# Altium schematic sheet complete.SchDoc (part 2 of 2)
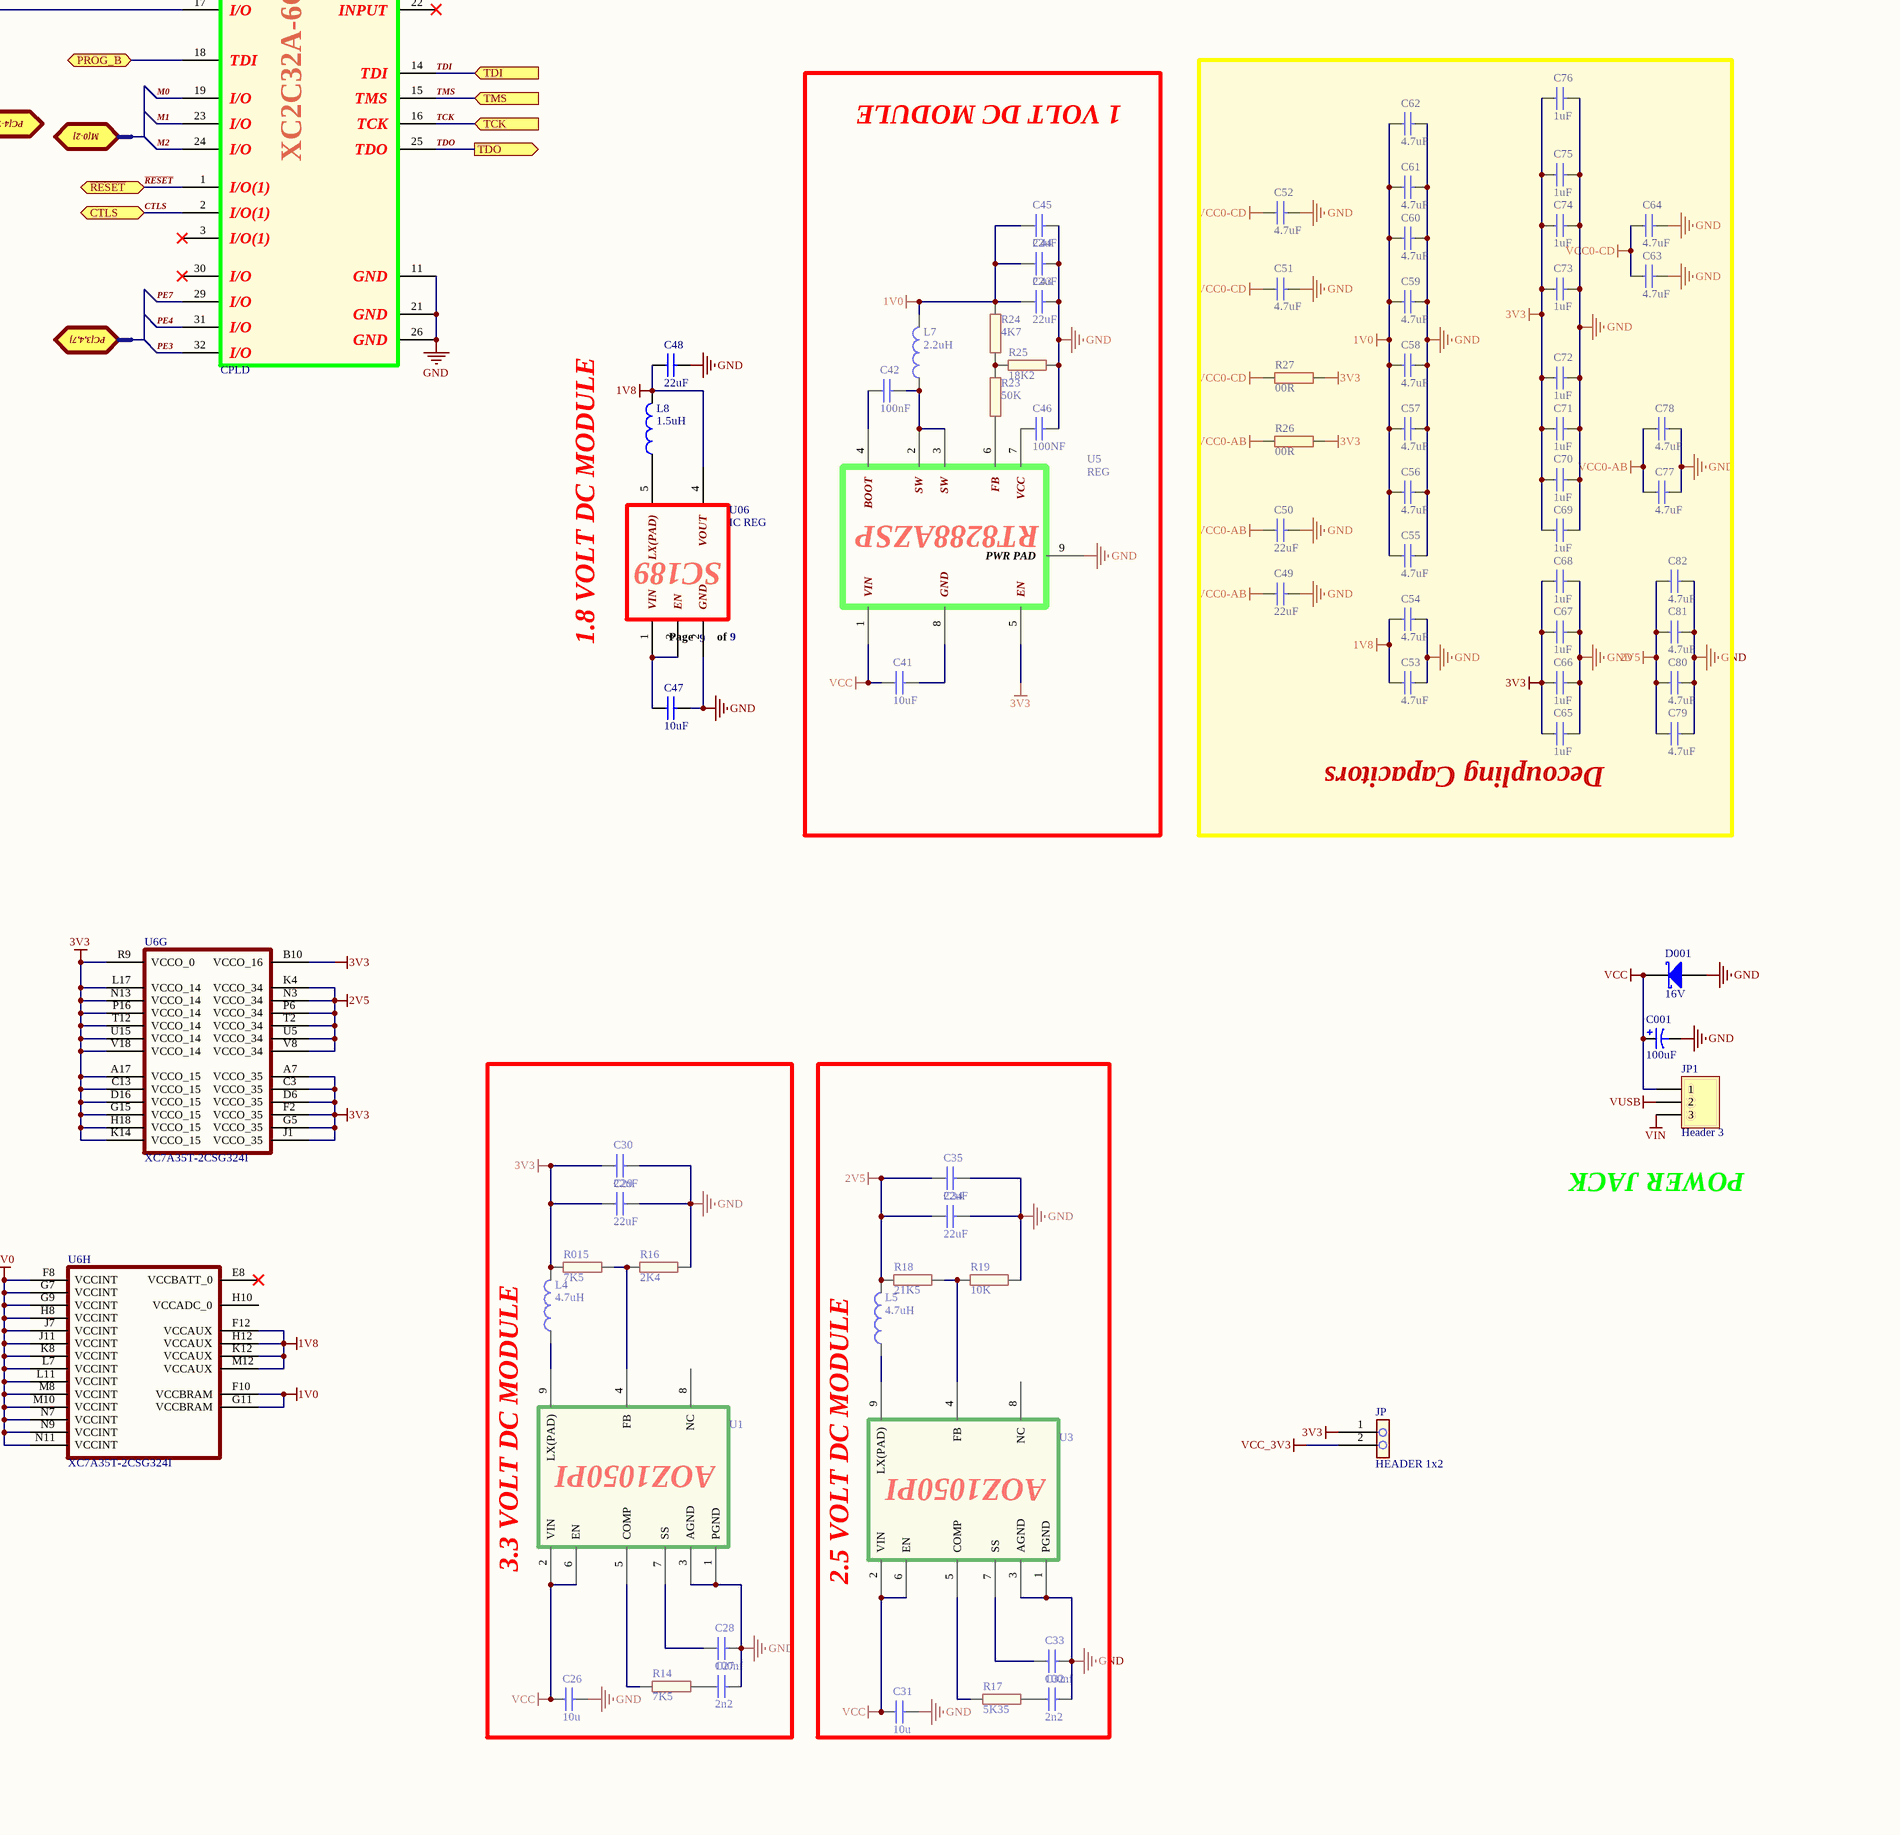
[diagram p6: complete.SchDoc, bottom right]

## Library data of the parts
B1 B1A = Balun_2.4GHz: 2.45 GHz Balun / Filter Combination; PartGroup: Inductors,RF,Other RF; Manufacturer: Johanson Technology; AN: A03-0130; TemperatureRange: -40 to +85; ComponentStatus: 'Active (verified)'; Height: 1; MPN: 2450FB15A050; FootprintStatus: 'Active (Verified)'
C01 C002 C49-C68 = CAP-NONPOL: Ceramic capacitor, SMD 0402, X5R, 6.3V, +/-20% (de33687); PartGroup: Capacitors,Ceramic,SMD 0402; Manufacturer: Murata; MPN: GRM155R60J475ME87D; AN: A01-0347; Tolerance: +-20%; TemperatureRange: -55°C to +85°C; ComponentStatus: 'Active (verified)'; Status: Active; Verified by: Lars Helge Mo; Verified date: 2005-12-15; Height: 0,5; FootprintStatus: 'Active (Verified)'
C1 C1A C9 C11 C13 C13A C14 C14A C15 C15A C16 C16A C17 C17A C110 = A01-0246: Ceramic capacitor, SMD 0402, X7R, 16V, +/-10%; PartGroup: Capacitors,Ceramic,SMD 0402; Manufacturer: Kemet; MPN: C0402C104K4RACTU; TemperatureRange: -55 - +125 deg C; ComponentStatus: 'Active (verified)'; Status: Active; Verified by: Lars Helge Mo; Verified date: 2005-12-15; AN: A01-0246; Tolerance: 16V, +/-10%; Height: 0.5; FootprintStatus: 'Active (Verified)'
C001 = Cap Pol1: Polarized Capacitor (Radial); Published: 8-Jun-2000; LatestRevisionDate: 17-Jul-2002; LatestRevisionNote: Re-released for DXP Platform.; PackageReference: RB7.6-15; Publisher: Altium Limited; PackageDescription: Polarized Capacitor (Radial); 2 Leads
C2 C02A C12 C12A = A01-0682: CAP CER 1.8PF 25V NP0 0201; PartGroup: Capacitors,Ceramic,SMD 0201; Tolerance: Â±0.1pF; TemperatureRange: -55Â°C ~ 125Â°C; ComponentStatus: 'New (not verified)'; Status: Active; Verified by: Lars Helge Mo; Verified date: 2005-12-15; AN: A01-0682; FootprintStatus: 'Active (Verified)'
C3 C3A = A01-0683: CAP CER 0.8PF 25V NP0 0201; PartGroup: Capacitors,Ceramic,SMD 0201; Manufacturer: Johanson Technology; MPN: 250R05L0R8AV4T; Tolerance: Â±0.05pF; TemperatureRange: -55Â°C ~ 125Â°C; ComponentStatus: 'New (not verified)'; Status: Active; Verified by: Lars Helge Mo; Verified date: 2005-12-15; AN: A01-0683; FootprintStatus: 'Active (Verified)'
C4 C4A C21 C21A = A01-0612: Ceramic Capacitor, SMD 0201, 25V, NP0, 1.2pF; PartGroup: Capacitors,Ceramic,SMD 0201; ComponentStatus: 'Active (verified)'; Status: Active; Verified by: Lars Helge Mo; Verified date: 2005-12-15; AN: A01-0612; FootprintStatus: 'Active (Verified)'
C5 C5A = A01-0681: CAP CER 8.2PF 25V NP0 0201; PartGroup: Capacitors,Ceramic,SMD 0201; Manufacturer: Johanson Technology; MPN: 250R05L8R2CV4T; Tolerance: Â±0.25pF; TemperatureRange: -55Â°C ~ 125Â°C; ComponentStatus: 'New (not verified)'; Status: Active; Verified by: Lars Helge Mo; Verified date: 2005-12-15; AN: A01-0681; FootprintStatus: 'Active (Verified)'
C7 C7A C22 C22A = A01-0472: CAP CER 2.2PF 6.3V NP0 0201; PartGroup: Capacitors,Ceramic,SMD 0201; Manufacturer: Kemet; MPN: CBR02C229C9GAC; Tolerance: ±0.25pF; TemperatureRange: -55°C ~ 125°C; ComponentStatus: 'Active (verified)'; Status: Active; Verified by: Lars Helge Mo; Verified date: 2005-12-15; AN: A01-0472; Height: 0.300000011920929; FootprintStatus: 'Active (Verified)'
C8 C08A = A01-0611: CAP CER 15PF 25V NP0 0201; PartGroup: Capacitors,Ceramic,SMD 0201; Manufacturer: Murata; MPN: GRM0335C1E150JA01D; Tolerance: Â±5%; TemperatureRange: -55Â°C to 125Â°C; ComponentStatus: 'Active (verified)'; Status: Active; Verified by: Lars Helge Mo; Verified date: 2005-12-15; AN: A01-0611; Height: 0.300000011920929; FootprintStatus: 'Active (Verified)'
C10 C10A = A01-0581: CAP CER 10PF 25V Â±.25pf ( and Â±.30ppm/ degree C of temp variation) NP0 0201; PartGroup: Capacitors,Ceramic,SMD 0201; Manufacturer: tdk; MPN: C0603C0G1E100C; Tolerance: Â±20ppm to Â±50ppm; TemperatureRange: -55CÂº ~ +125ÂºC; ComponentStatus: 'Active (verified)'; Status: Active; Verified by: Lars Helge Mo; Verified date: 2005-12-15; AN: A01-0581; FootprintStatus: 'Active (Verified)'
C18 C18A C19 C19A C20 C20A = A01-0286: Ceramic capacitor, SMD 0402, X5R, 6.3V, +/-10% (de26942); PartGroup: Capacitors,Ceramic,SMD 0402; Manufacturer: Kemet; MPN: C0402C105K9PAC; TemperatureRange: -55 to 85 deg C; ComponentStatus: 'Active (verified)'; Status: Active; Verified by: Lars Helge Mo; Verified date: 2005-12-15; AN: A01-0286; Tolerance: +/-10%; Height: 0.5; FootprintStatus: 'Active (Verified)'
C23 C230 = A01-0276: Ceramic capacitor, SMD 1206, X5R, 6.3V, ±10%; PartGroup: Capacitors,Ceramic,SMD 1206; Manufacturer: Murata; MPN: GRM319R60J106KE19; TemperatureRange: -55 to +125; ComponentStatus: 'Active (verified)'; Status: Active; Verified by: Lars Helge Mo; Verified date: 2005-12-15; AN: A01-0276; Tolerance: ±10%; Height: 0.850000023841858; FootprintStatus: 'Active (Verified)'
C24 C24A = A01-0351: Ceramic capacitor, SMD 0402, NP0, 50V, +/-0.25pF (de23847); PartGroup: Capacitors,Ceramic,SMD 0402; Manufacturer: Murata; MPN: GRM1555C1H2R2CZ01D; Tolerance: 0,25pF; TemperatureRange: -55ï¿½C to +125ï¿½C; ComponentStatus: 'Active (verified)'; Status: Active; Verified by: Lars Helge Mo; Verified date: 2005-12-15; AN: A01-0351; FootprintStatus: 'Active (Verified)'
C024A = A01-0351: Ceramic capacitor, SMD 0402, NP0, 50V, +/-0.25pF (de23847); PartGroup: Capacitors,Ceramic,SMD 0402; Manufacturer: Murata; MPN: GRM1555C1H2R2CZ01D; Value: 2.2pF; Tolerance: 0,25pF; TemperatureRange: -55ï¿½C to +125ï¿½C; ComponentStatus: 'Active (verified)'; Status: Active; Verified by: Lars Helge Mo; Verified date: 2005-12-15; AN: A01-0351; FootprintStatus: 'Active (Verified)'
C25 C25A = A01-0577: Ceramic capacitor, SMD 0201, X7R, 10V, +/-10%; PartGroup: Capacitors,Ceramic,SMD 0201; Manufacturer: Johanson Technology; MPN: 100R05W102KV4; ComponentStatus: 'New (not verified)'; Status: Active; Verified by: Lars Helge Mo; Verified date: 2005-12-15; AN: A01-0577; FootprintStatus: 'Active (Verified)'
C26 C27 C31 C32 = CAP-NONPOL_1: Ceramic capacitor, SMD 1206, X5R, 6.3V, ±10%; PartGroup: Capacitors,Ceramic,SMD 1206; Manufacturer: Murata; MPN: GRM319R60J106KE19; AN: A01-0276; TemperatureRange: -55 to +125; ComponentStatus: 'Active (verified)'; Status: Active; Verified by: Lars Helge Mo; Verified date: 2005-12-15; Tolerance: ±10%; Height: 0.850000023841858; FootprintStatus: 'Active (Verified)'
C28 C33 = CAP-NONPOL_1: PartGroup: Capacitors,Ceramic,SMD 1206; Manufacturer: Murata; MPN: GRM319R60J106KE19; AN: A01-0276; Tolerance: ±10%; TemperatureRange: -55 to +125; ComponentStatus: 'Active (verified)'; Status: Active; Verified by: Lars Helge Mo; Verified date: 2005-12-15; Height: 0.850000023841858; FootprintStatus: 'Active (Verified)'
C29 C30 C34 C35 C41-C48 = CAP-NONPOL_2: PartGroup: Capacitors,Ceramic,SMD 0402; Manufacturer: Murata; MPN: GRM1555C1H2R2CZ01D; AN: A01-0351; Tolerance: 0,25pF; TemperatureRange: -55ï¿½C to +125ï¿½C; ComponentStatus: 'Active (verified)'; Status: Active; Verified by: Lars Helge Mo; Verified date: 2005-12-15; FootprintStatus: 'Active (Verified)'
C69-C82 = CAP-NONPOL: PartGroup: Capacitors,Ceramic,SMD 0402; Manufacturer: Murata; MPN: GRM155R60J475ME87D; AN: A01-0347; Tolerance: +-20%; TemperatureRange: -55°C to +85°C; ComponentStatus: 'Active (verified)'; Status: Active; Verified by: Lars Helge Mo; Verified date: 2005-12-15; Height: 0,5; FootprintStatus: 'Active (Verified)'
C85-C97 = CAP-NONPOL_3: Ceramic capacitor, SMD 0201, X7R, 10V, +/-10%; PartGroup: Capacitors,Ceramic,SMD 0201; Manufacturer: Johanson Technology; MPN: 100R05W102KV4; AN: A01-0577; ComponentStatus: 'New (not verified)'; Status: Active; Verified by: Lars Helge Mo; Verified date: 2005-12-15; FootprintStatus: 'Active (Verified)'
D1 D1A = A10-0018: LED, Green, Wave length=575nm, SMD 0805, ±70°; PartGroup: Opto,LEDs,SMD; Manufacturer: Everlight; TemperatureRange: -40 - +85 deg C; ComponentStatus: 'Active (verified)'; Verified date: 2006-02-17; Verified by: Sveinung Helgeland; Status: Active; AN: A10-0018; Height: 1.10000002384186; MPN: EL17-21SYGC; FootprintStatus: 'Active (Verified)'
D001 DA DB DC DD = D Schottky: Schottky Diode; Published: 8-Jun-2000; LatestRevisionDate: 17-Jul-2002; LatestRevisionNote: Re-released for DXP Platform.; PackageReference: SMB; Publisher: Altium Limited; PackageDescription: DO-214-AA/SMB; 2 C-Bend Leads; Body 5.3 x 3.6 mm, inc. leads (LxW); Code_JEDEC: DO-214-AA
D2 D2A = A10-0019: LED, Yellow, Wave length=591nm, SMD 0805, ±70°; PartGroup: Opto,LEDs,SMD; Manufacturer: Everlight; MPN: 17-21UYC/S530-A3/TR8; TemperatureRange: -40 to +85 deg C; ComponentStatus: 'Active (verified)'; Verified date: 2006-02-17; Verified by: Sveinung Helgeland; Status: Active; AN: A10-0019; Height: 1.10000002384186; FootprintStatus: 'Active (Verified)'
D2A1 = LED0: Typical INFRARED GaAs LED; Published: 8-Jun-2000; LatestRevisionDate: 08-Jul-2005; LatestRevisionNote: Mech Layer 1 removed.; PackageReference: LED-0; Publisher: Altium Limited; PackageDescription: LED; 2 Leads
IC2 IC2A = AT24MAC602: IC EEPROM 2KBIT 1MHz, 1.7V to 5.5V, SOT23-5; PartGroup: Integrated Circuits,Memory,EEPROM; Manufacturer: ATMEL; AN: A06-0871; ComponentStatus: 'Active (verified)'; Status: *; Design comment: *; Verified by: *; Verified date: *; Height: 1.10000002384186; MPN: AT24MAC602-STUM-T; FootprintStatus: 'Active (Verified)'
IC7 IC7A = AT86RF215: Sub-1GHz/2.4GHz Transceiver; PartGroup: Integrated Circuits,Interface ICs,RF; Manufacturer: ATMEL; AN: A06-0976; Value: AT86RF215-ZU; TemperatureRange: -40Â°C to +85Â°C; ComponentStatus: 'Active (verified)'; MPN: AT86RF215-ZU; FootprintStatus: 'New (Not verified)'
IC8 = PL133-27: 1:2 FANOUT BUFFER IC
J1 J10 J104 J104A J105 J105A = A08-1754: 1x2 pin header, 2.54mm pitch, Pin-in-Paste THM; PartGroup: Mechanical devices,Connectors,Pin headers; Manufacturer: SAMTEC; TemperatureRange: - 55 deg C to + 125 deg C; ComponentStatus: 'Active (verified)'; Verified date: 2006-01-30; Verified by: Lars Helge; Status: Active; AN: A08-1754; Height: 6.09999990463257; MPN: HMTSW-102-23-F-S-237; FootprintStatus: 'Active (Verified)'
JP = A08-1754: 1x2 pin header, 2.54mm pitch, Pin-in-Paste THM; PartGroup: Mechanical devices,Connectors,Pin headers; Manufacturer: SAMTEC; MPN: HMTSW-102-23-F-S-237; TemperatureRange: - 55 deg C to + 125 deg C; ComponentStatus: 'Active (verified)'; Verified date: 2006-01-30; Verified by: Lars Helge; Status: Active; AN: A08-1754; Height: 6.09999990463257; FootprintStatus: 'Active (Verified)'
JP1 = Header 3: Header, 3-Pin; LatestRevisionDate: 17-Jul-2002; LatestRevisionNote: Re-released for DXP Platform.; Publisher: Altium Limited
L1 L1A = A03-0131: Sub-1GHz Balun; PartGroup: Inductors,RF,Other RF; Manufacturer: Murata; ComponentStatus: 'Active (verified)'; Common ode hoke: DLW21SN900SQ2; AN: A03-0131; MPN: DLW21SN900SQ2; FootprintStatus: 'New (Not verified)'
L2 L20 = A03-0072: SMD-Ferrite 220Ohm, 100MHz 0603 size, (de14411); PartGroup: Inductors,EMI; Manufacturer: Würth Elektronik; TemperatureRange: -55 - +125 deg C; ComponentStatus: 'Active (verified)'; AN: A03-0072; MPN: 74279263; FootprintStatus: 'Active (Verified)'
L3 L3A = A03-0150: PartGroup: Inductors,RF,SMD 0201; Manufacturer: Johanson Technology; MPN: L-05B5N6SV6T; Tolerance: ±0.3nH; TemperatureRange: -40°C ~ 100°C; ComponentStatus: 'Active (verified)'; Verified date: 2006-01-30; Verified by: Lars Helge Mo; Status: Active; AN: A03-0150; FootprintStatus: 'Active (Verified)'
L4 L5 L7 L8 = INDUCTOR: PartGroup: Inductors,RF,SMD 0201; Manufacturer: Johanson Technology; MPN: L-05B5N6SV6T; AN: A03-0150; Tolerance: ±0.3nH; TemperatureRange: -40°C ~ 100°C; ComponentStatus: 'Active (verified)'; Verified date: 2006-01-30; Verified by: Lars Helge Mo; Status: Active; FootprintStatus: 'Active (Verified)'
P1A = A08-0838: UFL (Small Coax Connector); PartGroup: Mechanical devices,Connectors,Coaxial; Manufacturer: HIROSE; ComponentStatus: 'Active (verified)'; AN: A08-0838; Height: 1.25; MPN: U.FL-R-SMT-1(10); FootprintStatus: 'Active (Verified)'
P4 = Header 2: Header, 2-Pin; LatestRevisionDate: 17-Jul-2002; LatestRevisionNote: Re-released for DXP Platform.; Publisher: Altium Limited
P-ADC = Header 10X2H: Header, 10-Pin, Dual row, Right Angle; LatestRevisionDate: 17-Jul-2002; LatestRevisionNote: Re-released for DXP Platform.; Publisher: Altium Limited
Pio = Header 20: Header, 20-Pin; LatestRevisionDate: 17-Jul-2002; LatestRevisionNote: Re-released for DXP Platform.; Publisher: Altium Limited
Q1 Q10 = A05-0051: Dual N-Channel MOSFET, 60V, 115mA cont,RDS(ON) < 7.5 Ohm @50mA@5V, SOT-363; PartGroup: Transistors,Small signal FET,SMD; Manufacturer: Fairchild; TemperatureRange: -65 to 150 deg C; ComponentStatus: 'Active (verified)'; Status: New; AN: A05-0051; Height: 1.10000002384186; MPN: 2N7002DW; FootprintStatus: 'Active (Verified)'
R001 R002 R018 R019 R032 R144-R147 = R2: Thick film resistor, SMD 0402, 1/16W, 1%; PartGroup: Resistors,SMD,0402 1%; AN: A02-0260; TemperatureRange: -55 - +125 deg C; ComponentStatus: 'Active (verified)'; Status: Active; Verified by: Lars Helge Mo; Verified date: 2005-12-19; Tolerance: 1 %; Height: 0,349999994039536; FootprintStatus: 'Active (Verified)'
R1 R1A R5 R5A = A02-0284: Thick film resistor, SMD 0402, 1/16W, 1%; PartGroup: Resistors,SMD,0402 1%; Manufacturer: KOA; MPN: RK73H1ETTP1004F; TemperatureRange: -55 - +125 deg C; ComponentStatus: 'Active (verified)'; Status: Active; Verified by: Lars Helge Mo; Verified date: 2005-12-19; AN: A02-0284; Tolerance: 1 %; Height: 0.349999994039536; FootprintStatus: 'Active (Verified)'
R2 R2A R3 R3A = A02-0200: Thick film resistor, SMD 0402, 1/16W, 1%; PartGroup: Resistors,SMD,0402 1%; TemperatureRange: -55 - +125 deg C; ComponentStatus: 'Active (verified)'; Status: Active; Verified by: Lars Helge Mo; Verified date: 2005-12-19; AN: A02-0200; Tolerance: 1 %; Height: 0.349999994039536; FootprintStatus: 'Active (Verified)'
R4 R4A R9 R9A = A02-0553: Thick film resistor, SMD 0201, 1/20W, 5%; PartGroup: Resistors,SMD,0201 5%; Manufacturer: ROHM; MPN: MCR006YZPJ000; ComponentStatus: 'Active (verified)'; Status: Active; Verified by: Lars Helge Mo; Verified date: 2005-12-19; AN: A02-0553; Tolerance: 5%; FootprintStatus: 'Active (Verified)'
R7 R7A = A02-0677: RES 100K OHM 1/20W 5% 0201 SMD; PartGroup: Resistors,SMD,0201 5%; Manufacturer: YAGEO CORP; MPN: RC0201JR-07100KL; ComponentStatus: 'Active (verified)'; Status: Active; Verified by: Lars Helge Mo; Verified date: 2005-12-19; AN: A02-0677; FootprintStatus: 'Active (Verified)'
R10 R10A R11 R11A R13 R13A = A02-0541: Thick film resistor, SMD 0201, 1/20W, 5%; PartGroup: Resistors,SMD,0201 5%; Manufacturer: ROHM; MPN: MCR006YZPJ103+; ComponentStatus: 'Active (verified)'; Status: Active; Verified by: Lars Helge Mo; Verified date: 2005-12-19; AN: A02-0541; Tolerance: 5%; FootprintStatus: 'Active (Verified)'
R12 R12A = A02-0196: Thick film resistor, SMD 0402, 1/16W, 1%; PartGroup: Resistors,SMD,0402 1%; TemperatureRange: -55 - +125 deg C; ComponentStatus: 'Active (verified)'; Status: Active; Verified by: Lars Helge Mo; Verified date: 2005-12-19; AN: A02-0196; Tolerance: 1 %; Height: 0.349999994039536; FootprintStatus: 'Active (Verified)'
R14 R015-R19 R23-R27 = R2_1: Thick film resistor, SMD 0201, 1/20W, 5%; PartGroup: Resistors,SMD,0201 5%; Manufacturer: ROHM; MPN: MCR006YZPJ103+; AN: A02-0541; ComponentStatus: 'Active (verified)'; Status: Active; Verified by: Lars Helge Mo; Verified date: 2005-12-19; Tolerance: 5%; FootprintStatus: 'Active (Verified)'
R15B R40-R51 R53-R58 R60-R79 = Res1: Resistor; Published: 8-Jun-2000; LatestRevisionDate: 17-Jul-2002; LatestRevisionNote: Re-released for DXP Platform.; PackageReference: AXIAL-0.3; Publisher: Altium Limited; PackageDescription: Axial Device, Thru-Hole; 2 Leads; 0.3 in Pin Spacing
R101 R101A R102 R102A = A02-0236: Thick film resistor, SMD 0402, 1/16W, 1%; PartGroup: Resistors,SMD,0402 1%; Manufacturer: vishay; MPN: CRCW040210K0FKED; TemperatureRange: -55 - +125 deg C; ComponentStatus: 'Active (verified)'; Status: Active; Verified by: Lars Helge Mo; Verified date: 2005-12-19; AN: A02-0236; Tolerance: 1 %; Height: 0.349999994039536; FootprintStatus: 'Active (Verified)'
SMA1-SMA4 = A08-1047: End Launch Jack Receptacle, Round Contact (de21535); Manufacturer: EMERSON; PartGroup: Mechanical devices,Connectors,Coaxial; Art.-Nr.: 21535; ComponentStatus: 'Active (verified)'; Manuf.Part#: 142-0711-821; AN: A08-1047; MPN: 142-0711-821; FootprintStatus: 'New (Not verified)'
TP1 TP1A TP2 TP2A TP10 TP10A TP11 TP11A TP12 TP12A TP13 TP13A = A08-0892: Single SMD testpad; PartGroup: Mechanical devices,Other; ComponentStatus: 'New (not verified)'; Status: Active; Verified by: Sveinung Helgeland; Verified date: 2006-02-17; AN: A08-0892; Height: 0; FootprintStatus: 'Active (Verified)'
TP8 TP9 = A08-1716: THM Test Point, Without Base, 1.0mm Dia. Mounting; PartGroup: Mechanical devices,Other; Manufacturer: Keystone Corp.; Value: 5012; ComponentStatus: 'Obsolete'; Status: Active; Verified by: Sveinung Helgeland; Verified date: 2006-02-17; AN: A08-1716; Height: 2.5; MPN: 5012; FootprintStatus: 'New (Not verified)'
U5 = RT8288AZSP: IC REG BUCK ADJ 4A SYNC 8SOP
U6 = XC7A35T-2CSG324I: Artix-7 FPGA, 210 User I/Os, 0 GTP, 324-Ball BGA, Speed Grade 2, Industrial Grade, Pb-Free; Manufacturer: Xilinx; Total Block RAM: 1800 Kb; GTP: 0; Clock Mgmt Tiles (CMTs): 5; Logic Cells: 33280; Available User I/O: 210; Speed Grades: 2; DatasheetVersion: v1.15; PackageVersion: Rev. 1.11; PackageReference: CSG-324; PackageDescription: 324-Ball Wire-Bond Chip-Scale BGA, Body 15 x 15 mm, Pitch 0.8 mm; Maximum Distributed RAM: 400 Kb; Operating Temperature Range: Industrial; NexusDeviceID: XC7A35T-2CSG324I; Mounting Technology: Surface Mount; PartNumber: XC7A35T-2CSG324I; ComponentLink1Description: Manufacturer URL; ComponentLink1URL: http://www.xilinx.com/; ComponentLink2Description: Datasheet; ComponentLink2URL: http://www.xilinx.com/support/documentation/data_sheets/ds180_7Series_Overview.pdf; ComponentLink3Description: Package Specification; ComponentLink3URL: http://www.xilinx.com/support/documentation/user_guides/ug475_7Series_Pkg_Pinout.pdf; ComponentLink4Description: DC and Switching Characteristics; ComponentLink4URL: http://www.xilinx.com/support/documentation/data_sheets/ds181_Artix_7_Data_Sheet.pdf; ComponentLink5Description: Package File; ComponentLink5URL: http://www.xilinx.com/support/packagefiles/a7packages/xc7a200tsbg484pkg.txt; ComponentLink6Description: Packaging and Pinout; ComponentLink6URL: http://www.xilinx.com/support/documentation/user_guides/ug475_7Series_Pkg_Pinout.pdf
U06 = SC189SKTRT: IC REG BUCK 1.8V 1.5A SYNC SOT23
U8 = XC2C32A-6QFG32C: IC CPLD 32MC 5.5NS 32QFN
U9 = S25FL127SABMFI101: IC FLASH 128MBIT 108MHZ 8SOIC
U10 = CY7C68014A-100AXC: EZ-USB FX2LP USB Microcontroller Ideal for Battery Powered Applications,16K RAM, 40 I/Os, 100-Pin TQFP, Pb-Free, Commercial Grade; Published: 16-Dec-2005; LatestRevisionDate: 13-Apr-2006; LatestRevisionNote: IPC-7351 Footprint Added.; DatasheetVersion: rev.J, Sep-2005; PackageVersion: Feb-2005; PackageReference: A101; Publisher: Altium Limited; PackageDescription: 100-Pin Thin Plastic Quad Flat Pack Rectangular 0.65 mm Pitch; ComponentLink1Description: Manufacturer Link; ComponentLink1URL: http://www.cypress.com/portal/server.pt; ComponentLink2Description: Datasheet; ComponentLink2URL: http://www.cypress.com/portal/server.pt/gateway/PTARGS_0_2_1524_209_259_43/http%3B/sjapp20.mis.cypress.com%3B7001/publishedcontent/publish/design_resources/datasheets/contents/cy7c68014a_5.pdf
U11 = UP SUPERVISORY
U12 = 24LC128SN
W1 W2 = Jumper: Jumper Wire; Published: 24-Mar-1999; LatestRevisionDate: 17-Jul-2002; LatestRevisionNote: Re-released for DXP Platform.; PackageReference: RAD-0.2; Publisher: Altium Limited; PackageDescription: Radial Cap, Thru-Hole; 2 Leads; 0.2 in Pin Spacing
XC1 = A07-0087: 26MHz TCXO, 2.8 ~ 3.3V, Clipped sine wave 10KOhm/10pF, 3.2 x 2.5 mm SMD; PartGroup: Frequency devices,Crystals,SMD; Manufacturer: Taiway Electronics; Tolerance: +/-2ppm; TemperatureRange: -20  to  +70Â°C; ComponentStatus: 'Active (verified)'; AN: A07-0087; MPN: TXETCCSANF-26.0000; FootprintStatus: 'Active (Verified)'
XC2 = ACT33T-4 TCXO: PartGroup: Frequency devices,Crystals,SMD; Manufacturer: Taiway Electronics; AN: A07-0087; Tolerance: +/-2ppm; TemperatureRange: -20  to  +70Â°C; ComponentStatus: 'Active (verified)'; Value: 26.0 MHz; MPN: TXETCCSANF-26.0000; FootprintStatus: 'Active (Verified)'
XL1 = ACT33T-4 TCXO_1: 26MHz TCXO, 2.8 ~ 3.3V, Clipped sine wave 10KOhm/10pF, 3.2 x 2.5 mm SMD; PartGroup: Frequency devices,Crystals,SMD; Manufacturer: Taiway Electronics; MPN: TXETCCSANF-26.0000; AN: A07-0087; Tolerance: +/-2ppm; TemperatureRange: -20  to  +70Â°C; ComponentStatus: 'Active (verified)'; Value: 26.0 MHz; FootprintStatus: 'Active (Verified)'